# Altium schematic sheet 11-红外遥控接收器模块--原理图.SchDoc
size A4
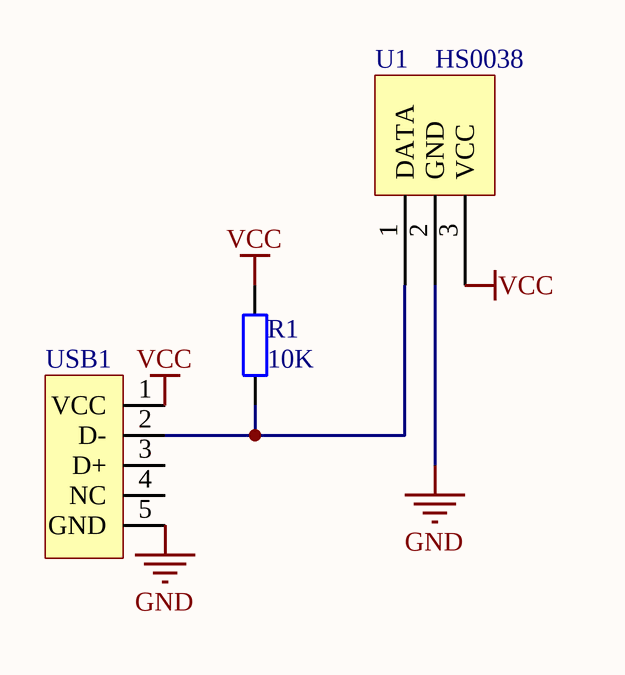
[diagram p0: 11-红外遥控接收器模块--原理图.SchDoc]

## Parts
R1  value 10K  [0805]  (hidden comment: res2)
U1  HS0038  [HS0038]
USB1  USB  [USB/SM0.8-6H5]  (value not drawn)

## Nets
GND: U1.2(GND) USB1.5(GND)
VCC: R1.1 U1.3(VCC) USB1.1(VCC)
NetR1_2: R1.2 U1.1(DATA) USB1.2(D-)

Not connected (* = marked no-connect by the designer): USB1 3(D+) 4(NC)

## Library data of the parts
R1 = res2: Resistor; Published: 8-Jun-2000; LatestRevisionDate: 17-Jul-2002; LatestRevisionNote: Re-released for DXP Platform.; PackageReference: AXIAL-0.4; Publisher: Altium Limited
USB1 = USB5